# EAGLE design smith_corona (EAGLE 6.5.0)
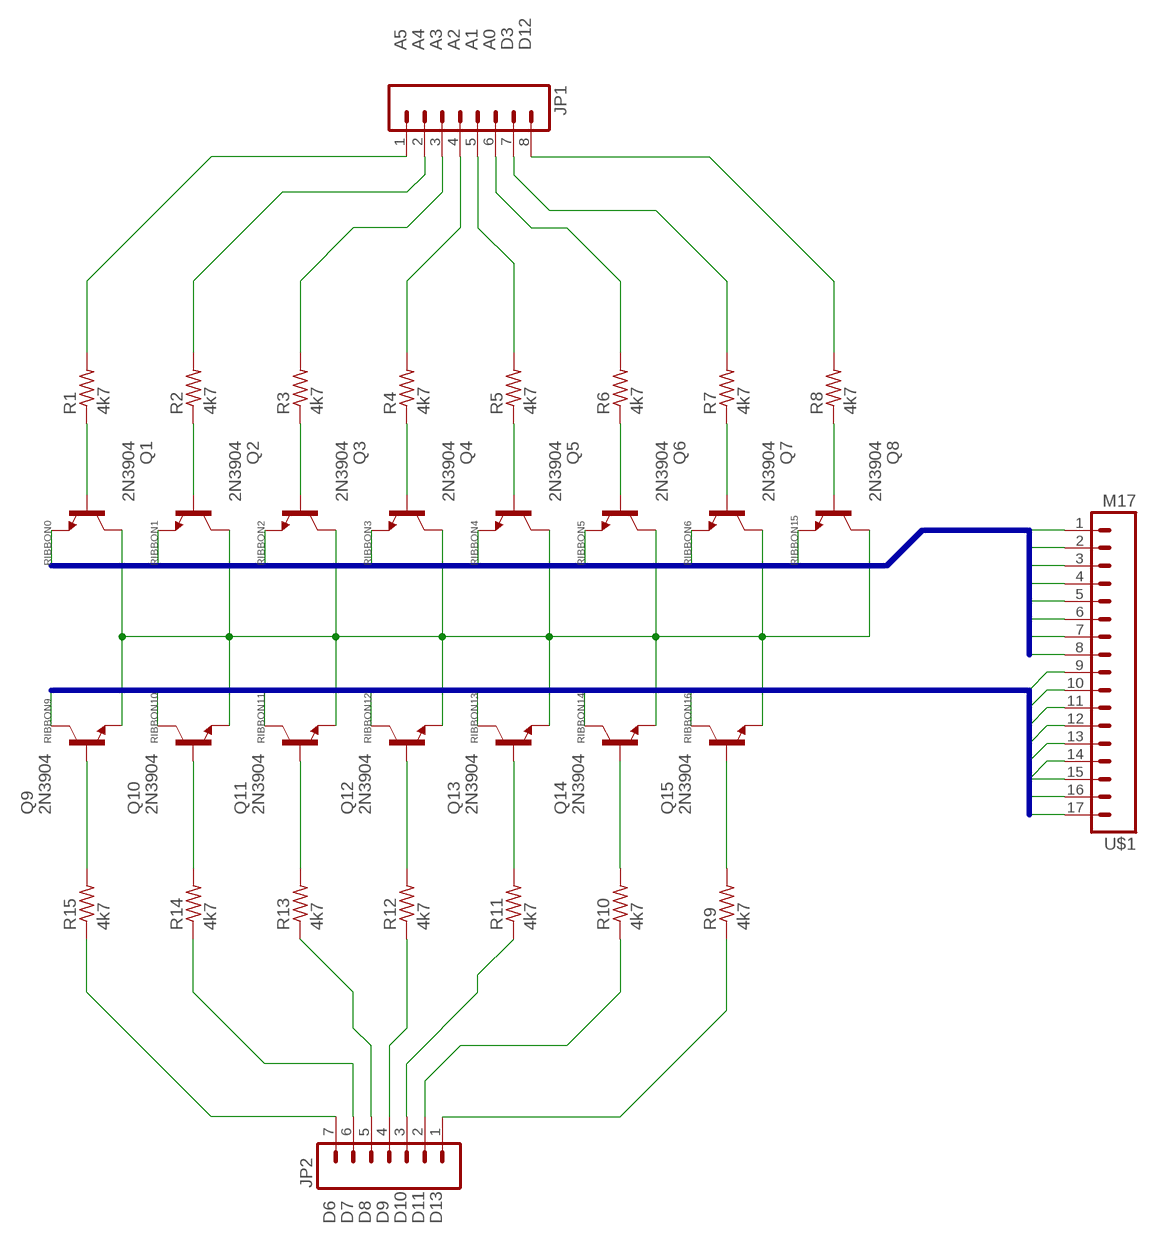
[diagram p0: schematic, sheet 1]

## Parts
JP1  M08LONGPADS  [1X08_LONGPADS]
JP2  M07LONGPADS  [1X07_LONGPADS]
Q1  2N3904  [TO92]
Q2  2N3904  [TO92]
Q3  2N3904  [TO92]
Q4  2N3904  [TO92]
Q5  2N3904  [TO92]
Q6  2N3904  [TO92]
Q7  2N3904  [TO92]
Q8  2N3904  [TO92]
Q9  2N3904  [TO92]
Q10  2N3904  [TO92]
Q11  2N3904  [TO92]
Q12  2N3904  [TO92]
Q13  2N3904  [TO92]
Q14  2N3904  [TO92]
Q15  2N3904  [TO92]
R1  4k7  R-US_0207/10  [0207/10]
R2  4k7  R-US_0207/10  [0207/10]
R3  4k7  R-US_0207/10  [0207/10]
R4  4k7  R-US_0207/10  [0207/10]
R5  4k7  R-US_0207/10  [0207/10]
R6  4k7  R-US_0207/10  [0207/10]
R7  4k7  R-US_0207/10  [0207/10]
R8  4k7  R-US_0207/10  [0207/10]
R9  4k7  R-US_0207/10  [0207/10]
R10  4k7  R-US_0207/10  [0207/10]
R11  4k7  R-US_0207/10  [0207/10]
R12  4k7  R-US_0207/10  [0207/10]
R13  4k7  R-US_0207/10  [0207/10]
R14  4k7  R-US_0207/10  [0207/10]
R15  4k7  R-US_0207/10  [0207/10]
U$1  M17  [1X17]

## Nets
A0: JP1.6 R6.2
A1: JP1.5 R5.2
A2: JP1.4 R4.2
A3: JP1.3 R3.2
A4: JP1.2 R2.2
A5: JP1.1 R1.2
D3: JP1.7 R7.2
D6: JP2.7 R15.1
D7: JP2.6 R14.1
D8: JP2.5 R13.1
D9: JP2.4 R12.1
D10: JP2.3 R11.1
D11: JP2.2 R10.1
D12: JP1.8 R8.2
D13: JP2.1 R9.1
N$1: Q1.2(B) R1.1
N$2: Q2.2(B) R2.1
N$3: Q3.2(B) R3.1
N$4: Q4.2(B) R4.1
N$5: Q5.2(B) R5.1
N$6: Q6.2(B) R6.1
N$7: Q7.2(B) R7.1
N$8: Q8.2(B) R8.1
N$9: Q15.2(B) R9.2
N$10: Q14.2(B) R10.2
N$11: Q13.2(B) R11.2
N$12: Q12.2(B) R12.2
N$13: Q11.2(B) R13.2
N$14: Q10.2(B) R14.2
N$15: Q9.2(B) R15.2
N$22: Q1.1(C) Q2.1(C) Q3.1(C) Q4.1(C) Q5.1(C) Q6.1(C) Q7.1(C) Q8.1(C) Q9.3(E) Q10.3(E) Q11.3(E) Q12.3(E) Q13.3(E) Q14.3(E) Q15.3(E)
RIBBON0: Q1.3(E) U$1.1
RIBBON1: Q2.3(E) U$1.2
RIBBON2: Q3.3(E) U$1.3
RIBBON3: Q4.3(E) U$1.4
RIBBON4: Q5.3(E) U$1.5
RIBBON5: Q6.3(E) U$1.6
RIBBON6: Q7.3(E) U$1.7
RIBBON7: U$1.8
RIBBON8: U$1.9
RIBBON9: Q9.1(C) U$1.10
RIBBON10: Q10.1(C) U$1.11
RIBBON11: Q11.1(C) U$1.12
RIBBON12: Q12.1(C) U$1.13
RIBBON13: Q13.1(C) U$1.14
RIBBON14: Q14.1(C) U$1.15
RIBBON15: Q8.3(E) U$1.16
RIBBON16: Q15.1(C) U$1.17

## Buses
RIBBON[0..16]

## Notes on the sheet
- A5 | A4 | A3 | A2 | A1 | A0 | D3 | D12
- D6 | D7 | D8 | D9 | D10 | D11 | D13

## Library data of the parts
JP1 = SparkFun:M08: Header 8 Standard 8-pin 0.1" header. Use with straight break away headers (SKU : PRT-00116), right angle break away headers (PRT-00553), swiss pins (PRT-00743), machine pins (PRT-00117), and female headers (PRT-00115).
JP2 = SparkFun:M07: Header 7 Standard 7-pin 0.1" header. Use with straight break away headers (SKU : PRT-00116), right angle break away headers (PRT-00553), swiss pins (PRT-00743), machine pins (PRT-00117), and female headers (PRT-00115). NOTES ON THE VARIANTS LOCK and LOCK_LONGPADS... This footprint was designed to help hold the alignment of a through-hole component (i.e. 7-pin header) while soldering it into place. You may notice that each hole has been shifted either up or down by 0.005 of an inch from it's more standard position (which is usually a perfectly straight line). This slight alteration caused the pins (the squares in the middle) to touch the edges of the holes. Because they are alternating, it causes a "brace" to hold the header in place. 0.005 has proven to be the perfect amount of "off-center" position when using our standard breakaway headers. Although looks a little odd when you look at the bare footprint, once you have a header in there, the alteration is very hard to notice. Also, if you push a header all the way into place, it is covered up entirely on the bottom side. This idea of altering the position of holes to aid alignment will be further integrated into the Sparkfun Library for other footprints. It can help hold any component with 3 or more connection pins.
Q1-Q15 = transistor-npn:2N3904: NPN Transistor
R1-R15 = rcl:R-US_: RESISTOR, American symbol
U$1 = SparkFun:M17

## Board
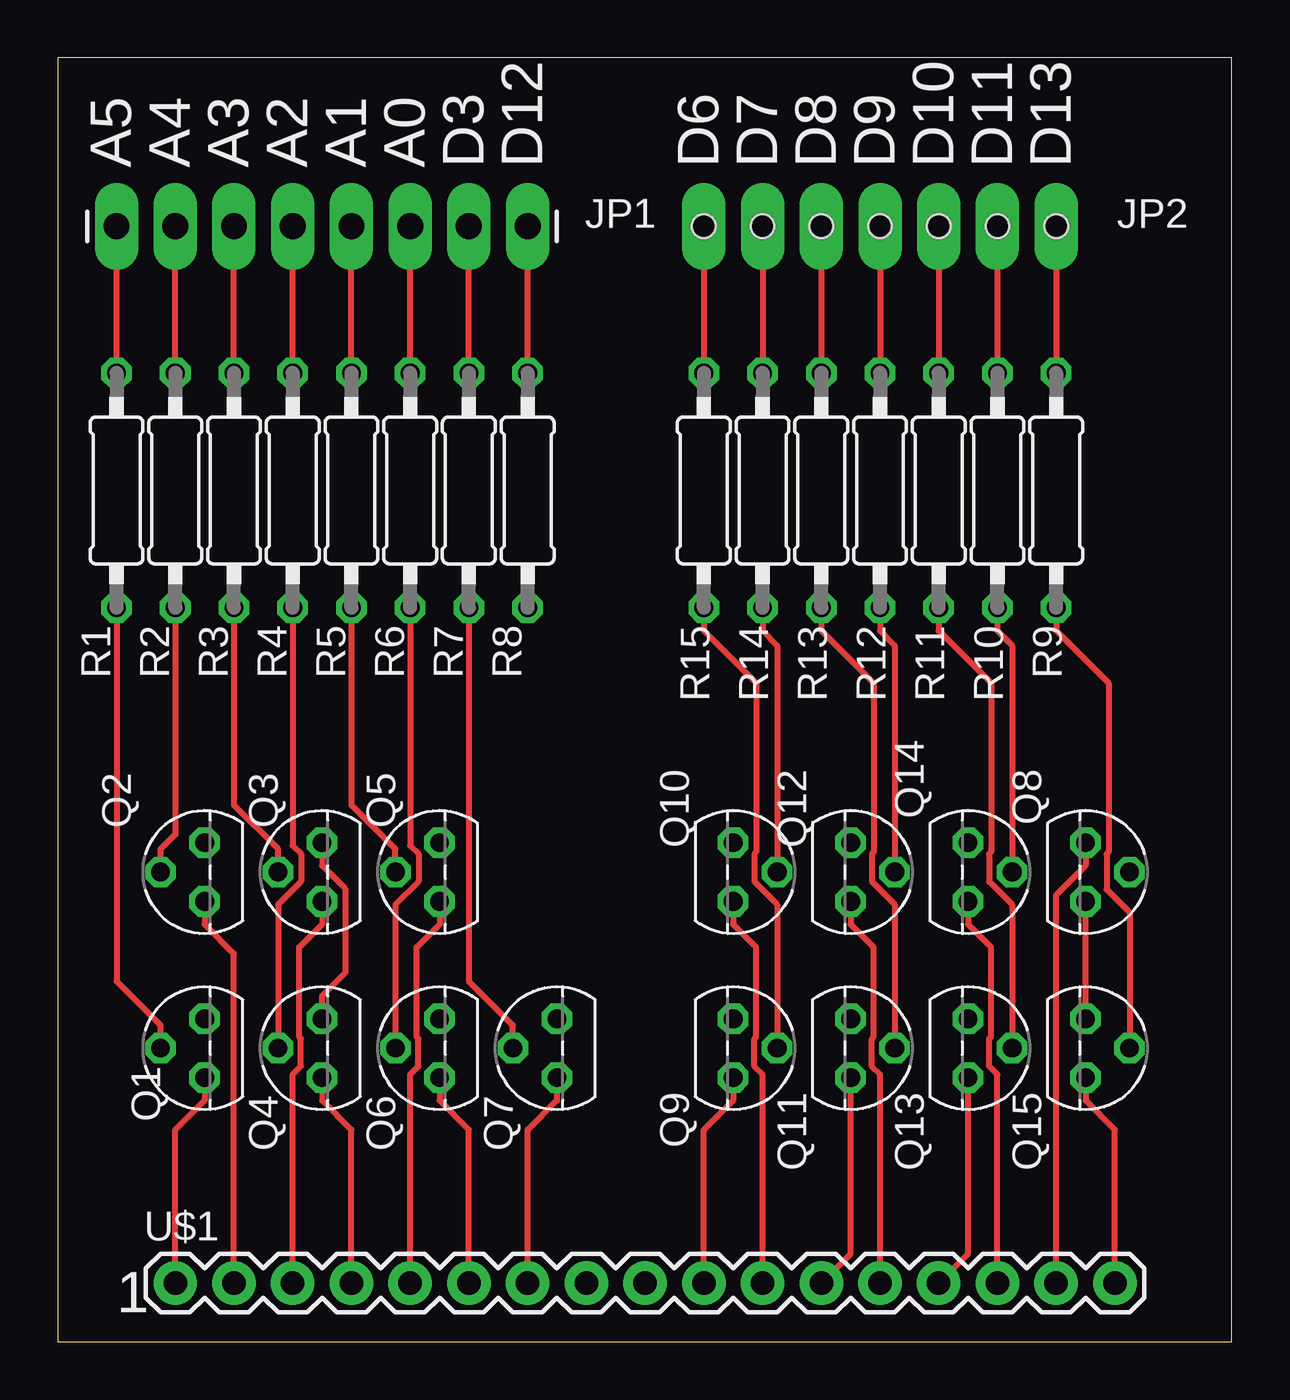
[diagram p1: board, top side]
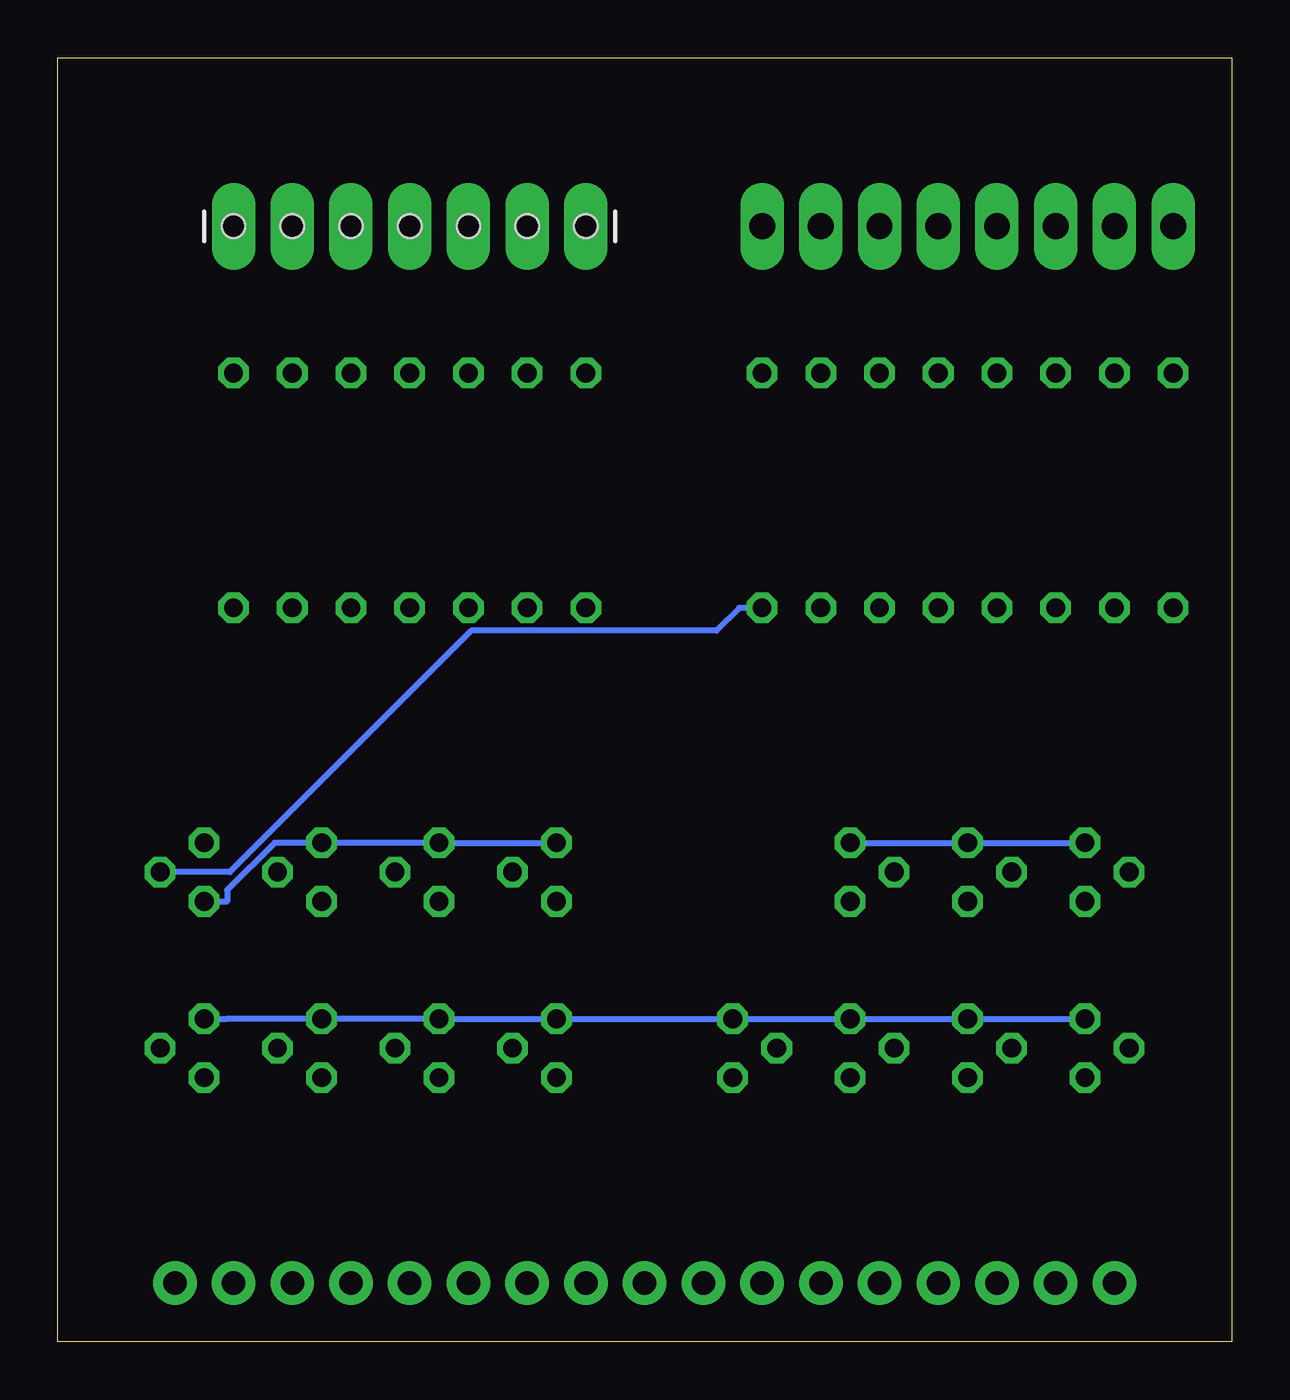
[diagram p2: board, bottom side, seen from below]

Size 50.78 x 55.55 mm. Coordinates in mm from the lower left corner, seen from the top.
Outline: 0,0 50.78,0 50.78,55.55 0,55.55 0,0
Copper layers (1*16): Top 0.035mm / dielectric 1.5mm / Bottom 0.035mm
Design rules "default": minimum track width 10mil, minimum drill 24mil, track to track 8mil, track to pad 8mil, pad to pad 8mil, via to via 8mil, smd to smd 8mil, copper to edge 40mil, drill to drill 8mil, minimum pad ring 10mil, minimum via ring 8mil, stop-mask expansion 4mil, vias tented up to drill 0mil, thermal gap 10mil

### Footprints (pad centres in the part's own frame; a part is rotated, then mirrored left to right if it is on the bottom)
1X08_LONGPADS = drill 1.118 pad 1.88 long: 1 0,0; 2 2.54,0; 3 5.08,0; 4 7.62,0; 5 10.16,0; 6 12.7,0; 7 15.24,0; 8 17.78,0
1X07_LONGPADS = drill 1.016 pad 1.88 long: 1 0,0; 2 2.54,0; 3 5.08,0; 4 7.62,0; 5 10.16,0; 6 12.7,0; 7 15.24,0 | hole 1.016: 0,0; 2.54,0; 5.08,0; 7.62,0; 10.16,0; 12.7,0; 15.24,0
TO92 = drill 0.813 octagon: 1 1.27,0; 2 0,1.905; 3 -1.27,0
0207/10 = drill 0.813 octagon: 1 -5.08,0; 2 5.08,0
1X17 = drill 1.016 pad 1.88: 1 0,0; 2 2.54,0; 3 5.08,0; 4 7.62,0; 5 10.16,0; 6 12.7,0; 7 15.24,0; 8 17.78,0; 9 20.32,0; 10 22.86,0; 11 25.4,0; 12 27.94,0; 13 30.48,0; 14 33.02,0; 15 35.56,0; 16 38.1,0; 17 40.64,0

### Placement (x,y rotation side)
JP1  2.54,48.26 0 top
JP2  43.18,48.26 0 bottom
Q1  6.35,12.7 90 top
Q2  6.35,20.32 90 top
Q3  11.43,20.32 90 top
Q4  11.43,12.7 90 top
Q5  16.51,20.32 90 top
Q6  16.51,12.7 90 top
Q7  21.59,12.7 90 top
Q8  44.45,20.32 270 top
Q9  29.21,12.7 270 top
Q10  29.21,20.32 270 top
Q11  34.29,12.7 270 top
Q12  34.29,20.32 270 top
Q13  39.37,12.7 270 top
Q14  39.37,20.32 270 top
Q15  44.45,12.7 270 top
R1  2.54,36.83 90 top
R2  5.08,36.83 90 top
R3  7.62,36.83 90 top
R4  10.16,36.83 90 top
R5  12.7,36.83 90 top
R6  15.24,36.83 90 top
R7  17.78,36.83 90 top
R8  20.32,36.83 90 top
R9  43.18,36.83 270 top
R10  40.64,36.83 270 top
R11  38.1,36.83 270 top
R12  35.56,36.83 270 top
R13  33.02,36.83 270 top
R14  30.48,36.83 270 top
R15  27.94,36.83 270 top
U$1  5.08,2.54 0 top

### Tracks (layer width: path | path; a pad name or v marks a point on that pad's centre or on a via)
A0
  Top 0.254: R6.2 JP1.6
A1
  Top 0.254: R5.2 JP1.5
A2
  Top 0.254: R4.2 JP1.4
A3
  Top 0.254: R3.2 JP1.3
A4
  Top 0.254: R2.2 JP1.2
A5
  Top 0.254: R1.2 JP1.1
D3
  Top 0.254: R7.2 JP1.7
D6
  Top 0.254: JP2.7 R15.1
D7
  Top 0.254: JP2.6 R14.1
D8
  Top 0.254: JP2.5 R13.1
D9
  Top 0.254: JP2.4 R12.1
D10
  Top 0.254: JP2.3 R11.1
D11
  Top 0.254: JP2.2 R10.1
D12
  Top 0.254: R8.2 JP1.8
D13
  Top 0.254: JP2.1 R9.1
N$1
  Top 0.254: Q1.2 4.45,13.69 2.54,15.6 R1.1
N$2
  Top 0.254: Q2.2 4.45,21.31 5.08,21.95 R2.1
N$3
  Top 0.254: Q3.2 9.53,21.31 7.62,23.22 R3.1
N$4
  Top 0.254: R4.1 10.16,21.46 10.52,21.1 10.52,19.91 9.53,18.92 Q4.2
N$5
  Top 0.254: Q5.2 14.61,21.31 12.7,23.22 R5.1
N$6
  Top 0.254: R6.1 15.24,21.46 15.6,21.1 15.6,19.91 14.61,18.92 Q6.2
N$7
  Top 0.254: Q7.2 19.68,13.69 17.78,15.6 R7.1
N$8
  Bottom 0.254: R8.1 21.31,31.75 22.3,30.76 32.9,30.76 43.34,20.32 Q8.2
N$9
  Top 0.254: R9.2 43.18,30.76 45.45,28.49 45.45,21.18 45.36,21.1 45.36,19.57 46.35,18.58 Q15.2
N$10
  Top 0.254: R10.2 40.64,30.76 41.27,30.12 Q14.2
N$11
  Top 0.254: Q13.2 41.27,18.92 40.28,19.91 40.28,21.1 40.36,21.18 40.36,28.5 38.1,30.76 R11.2
N$12
  Top 0.254: R12.2 35.56,30.76 36.2,30.12 Q12.2
N$13
  Top 0.254: Q11.2 36.2,18.92 35.2,19.91 35.2,21.1 35.28,21.18 35.28,28.5 33.02,30.76 R13.2
N$14
  Top 0.254: R14.2 30.48,30.76 31.11,30.12 Q10.2
N$15
  Top 0.254: Q9.2 31.11,18.92 30.12,19.91 30.12,21.1 30.2,21.18 30.2,28.5 27.94,30.76 R15.2
N$22
  Top 0.254: Q4.1 11.43,14.96 12.43,15.96 12.43,19.6 11.43,20.6 Q3.1 | Q15.3 Q8.1
  Bottom 0.254: Q2.1 Q3.1 Q5.1 | Q1.1 Q4.1 Q6.1 Q7.1 Q9.3 Q11.3 Q13.3 43.46,13.97 Q15.3 | Q8.1 43.46,19.05 43.46,19.54 41.41,21.59 Q14.3 Q12.3 Q10.3
RIBBON0
  Top 0.254: Q1.3 6.35,10.44 5.08,9.17 U$1.1
RIBBON1
  Top 0.254: Q2.3 6.35,18.06 7.62,16.79 U$1.2
RIBBON2
  Top 0.254: Q3.3 11.43,18.06 10.44,17.07 10.44,13.19 10.52,13.11 10.52,11.92 10.16,11.56 U$1.3
RIBBON3
  Top 0.254: Q4.3 11.43,10.44 12.7,9.17 U$1.4
RIBBON4
  Top 0.254: Q5.3 16.51,18.06 15.52,17.07 15.52,13.19 15.6,13.11 15.6,11.92 15.24,11.56 U$1.5
RIBBON5
  Top 0.254: Q6.3 16.51,10.44 17.78,9.17 U$1.6
RIBBON6
  Top 0.254: Q7.3 21.59,10.44 20.32,9.17 U$1.7
RIBBON9
  Top 0.254: Q9.1 29.21,10.44 27.94,9.17 U$1.10
RIBBON10
  Top 0.254: Q10.1 29.21,18.06 30.2,17.07 30.2,13.19 30.12,13.11 30.12,11.92 30.48,11.56 U$1.11
RIBBON11
  Top 0.254: U$1.12 34.29,3.81 Q11.1
RIBBON12
  Top 0.254: Q12.1 34.29,18.06 35.28,17.07 35.28,13.19 35.2,13.11 35.2,11.92 35.56,11.56 U$1.13
RIBBON13
  Top 0.254: U$1.14 39.37,3.81 Q13.1
RIBBON14
  Top 0.254: Q14.1 39.37,18.06 40.36,17.07 40.36,13.19 40.28,13.11 40.28,11.92 40.64,11.56 U$1.15
RIBBON15
  Top 0.254: Q8.3 44.45,20.6 43.18,19.33 U$1.16
RIBBON16
  Top 0.254: Q15.1 44.45,10.44 45.72,9.17 U$1.17

### Text on the board
tNames: A5 | A4 | A3 | A2 | A1 | A0 | D3 | D12 | D6 | D7 | D8 | D9 | D10 | D11 | D13 | 1